# EAGLE design Luminet2_Adapter (EAGLE 6.1)
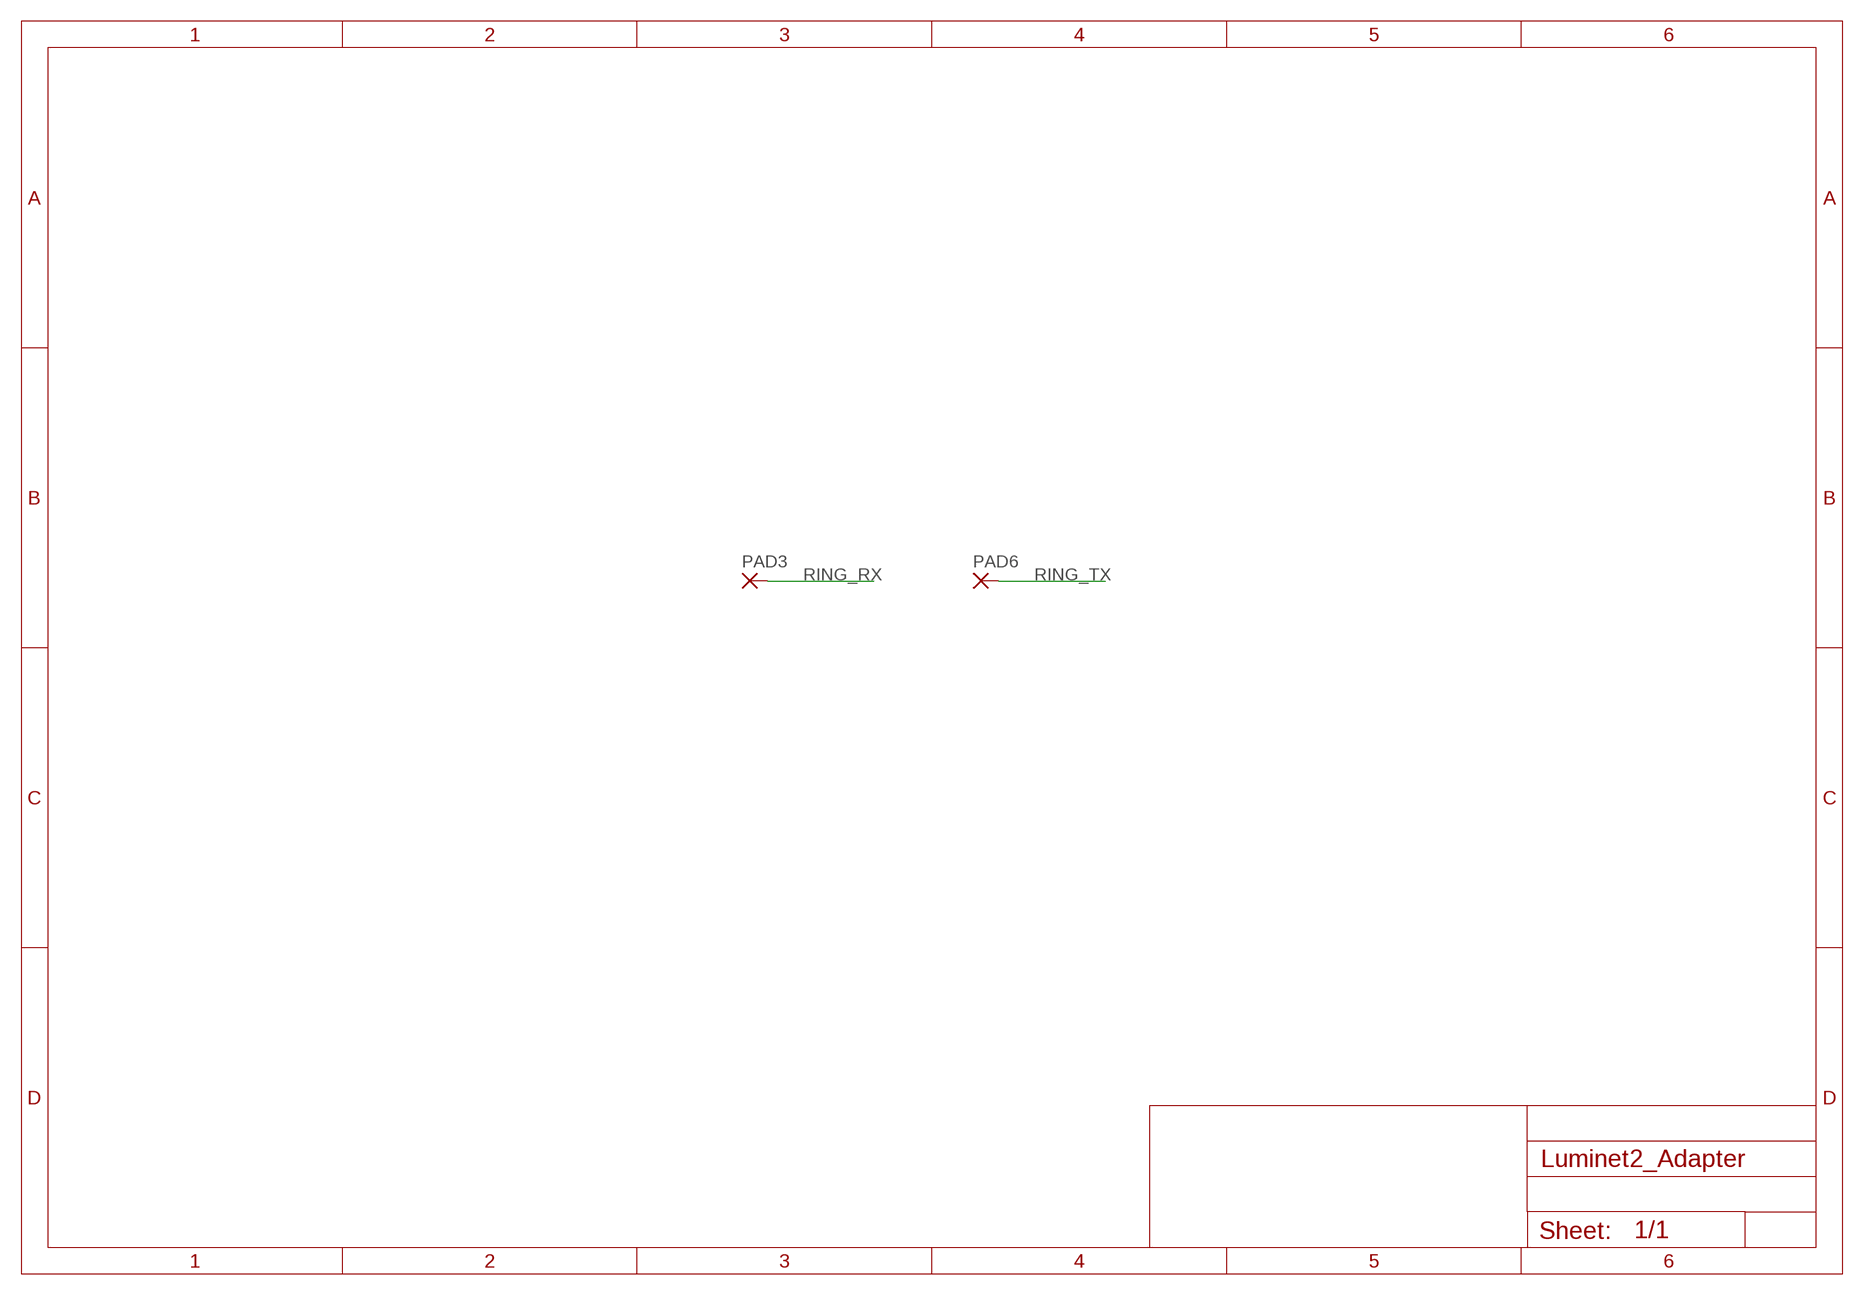
[diagram p0: schematic, sheet 1]

## Parts
PAD3  SMD2  [SMD1,27-2,54]
PAD6  SMD2  [SMD1,27-2,54]

## Nets
RING_RX: PAD3.1(P)
RING_TX: PAD6.1(P)

## Library data of the parts
PAD3 PAD6 = wirepad:SMD2: SMD PAD

## Board
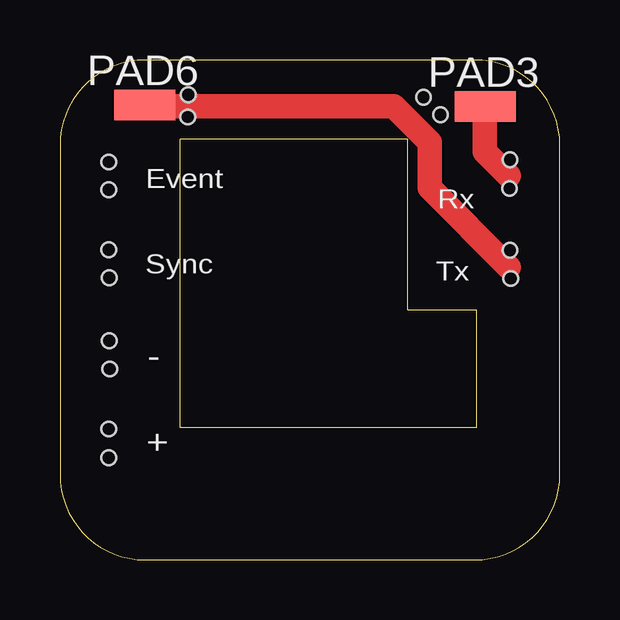
[diagram p1: board, top side]

Size 20.83 x 20.83 mm. Coordinates in mm from the lower left corner, seen from the top.
Outline: 17.27,0 arc90 20.83,3.56 20.83,17.27 arc90 17.27,20.83 3.56,20.83 arc90 0,17.27 0,3.56 arc90 3.56,0 17.27,0
Outline: 14.48,10.41 14.48,17.53 5,17.53 5,5.5 17.35,5.5 17.35,10.41 14.48,10.41
Copper layers (1*16): Top 0.035mm / dielectric 1.5mm / Bottom 0.035mm
Design rules: minimum track width 6mil, minimum drill 0.3mm, track to track 6mil, track to pad 6mil, pad to pad 6mil, via to via 6mil, smd to smd 6mil, copper to edge 20mil, drill to drill 8mil, minimum pad ring 8mil, minimum via ring 6mil, stop-mask expansion 3mil, vias tented up to drill 0mil, thermal gap 8mil
Holes 0.6 mm at 2.02,4.25 2.02,5.45 2.08,7.95 2.05,9.12 2.05,11.75 2.02,12.93 2.02,15.43 2.02,16.57 5.35,19.38 5.33,18.45 15.85,18.55 15.15,19.27 18.75,12.9 18.77,11.72 18.75,16.68 18.73,15.47

### Footprints (pad centres in the part's own frame; a part is rotated, then mirrored left to right if it is on the bottom)
SMD1,27-2,54 = smd 1.27 x 2.54: 1 0,0

### Placement (x,y rotation side)
PAD3  17.73,18.89 270 top
PAD6  3.52,18.96 270 top

### Tracks (layer width: path | path; a pad name or v marks a point on that pad's centre or on a via)
N$1
  Top 1.016: 3.5,18.9 13.9,18.9 15.4,17.4 15.4,15.5 18.7,12.2
N$2
  Top 1.016: 17.7,18.7 17.7,17 18.7,16

### Text on the board
tPlace: Event | Rx | Sync | Tx | - | +